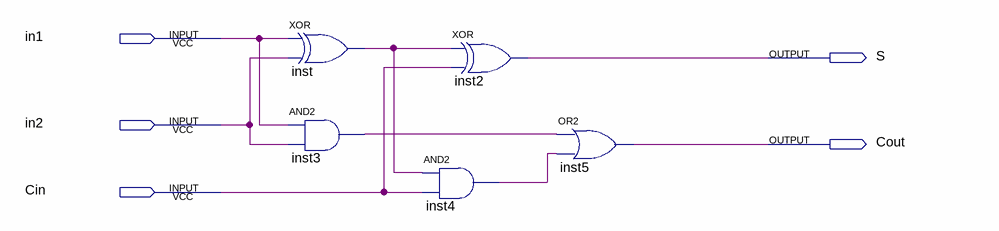
[diagram p0: schematic sheet]
// Quartus schematic one_bit_adder.bdf as structural Verilog: 5 symbols, 5 pins
module one_bit_adder (
  input  in1,
  input  in2,
  input  Cin,
  output S,
  output Cout
);

  wire inst3_out, inst4_out, inst_out;

  xor inst (inst_out, in1, in2);
  and inst3 (inst3_out, in1, in2);
  xor inst2 (S, inst_out, Cin);
  and inst4 (inst4_out, inst_out, Cin);
  or inst5 (Cout, inst3_out, inst4_out);
endmodule
